# EAGLE design TPS62237 Breakout (EAGLE 9.5.2)
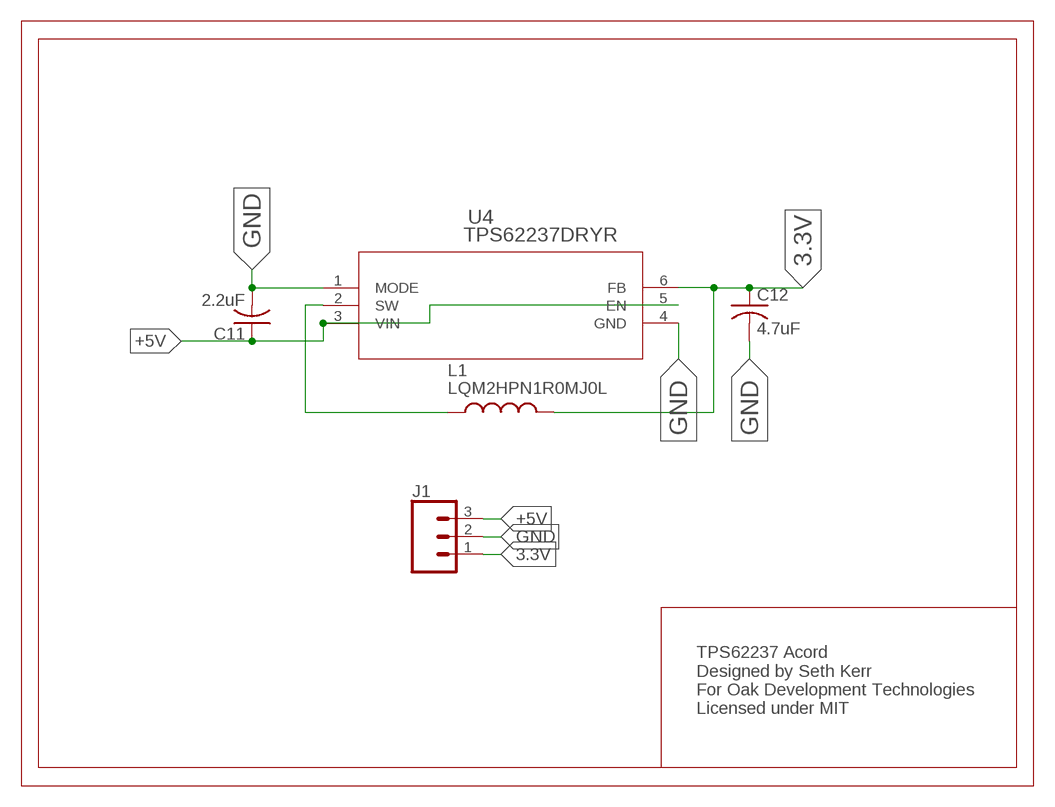
[diagram p0: schematic, sheet 1]

## Parts
C11  2.2uF  C-USC0603  [C0603]
C12  4.7uF  C-USC0603  [C0603]
J1  CONN_031X03_NO_SILK  [1X03_NO_SILK]
L1  LQM2HPN1R0MJ0L  [INDC2520X120N]
U4  TPS62237DRYR  [DRY6_TEX]

## Nets
3.3V: C12.1 J1.1 L1.2 U4.6(FB)
+5V: C11.1 J1.3 U4.3(VIN) U4.5(EN)
GND: C11.2 C12.2 J1.2 U4.1(MODE) U4.4(GND)
N$18: L1.1 U4.2(SW)

## Notes on the sheet
- TPS62237 Acord
  Designed by Seth Kerr
  For Oak Development Technologies
  Licensed under MIT

## Library data of the parts
C11 C12 = rcl:C-US: CAPACITOR, American symbol; SPICEPREFIX: C
J1 = SparkFun-Connectors:CONN_03: Multi connection point. Often used as Generic Header-pin footprint for 0.1 inch spaced/style header connections On any of the 0.1 inch spaced packages, you can populate with these: Break Away Headers - Straight <https://www.sparkfun.com/products/116> (PRT-00116) Break Away Male Headers - Right Angle <https://www.sparkfun.com/products/553> (PRT-00553) Female Headers <https://www.sparkfun.com/products/115> (PRT-00115) Break Away Headers - Machine Pin <https://www.sparkfun.com/products/117> (PRT-00117) Break Away Female Headers - Swiss Machine Pin <https://www.sparkfun.com/products/743> (PRT-00743) Stackable Header - 3 Pin (Female, 0.1") <https://www.sparkfun.com/products/13875> (PRT-13875) For SCREWTERMINALS and SPRING TERMINALS visit here: Screw Terimnals on SparkFun.com <https://www.sparkfun.com/search/results?term=Screw+Terminals> (5mm/3.5mm/2.54mm spacing) This device is also useful as a general connection point to wire up your design to another part of your project. Our various solder wires solder well into these plated through hole pads. Hook-Up Wire - Assortment (Stranded, 22 AWG) <https://www.sparkfun.com/products/11375> (PRT-11375) Hook-Up Wire - Assortment (Solid Core, 22 AWG) <https://www.sparkfun.com/products/11367> (PRT-11367) View the entire wire category on our website here <https://www.sparkfun.com/categories/141> Special notes: Molex polarized connector foot print use with SKU : PRT-08232 with associated crimp pins and housings.
L1 = LQM2HPN1R0MJ0L:LQM2HPN1R0MJ0L: FIXED IND 1UH 1.5A 90 MOHM SMD; ARROW_ELECTRONICS-PURCHASE-URL: https://snapeda.com/shop?store=Arrow+Electronics&id=53051; DESCRIPTION: Inductor with Inductance: 1uH Tol. +/-20%, Package: 1008 (2520); DIGI-KEY_PART_NUMBER: 490-6699-1-ND; DIGIKEY-PURCHASE-URL: https://snapeda.com/shop?store=DigiKey&id=53051; MF: Murata Electronics; MOUSER-PURCHASE-URL: https://snapeda.com/shop?store=Mouser&id=53051; MP: LQM2HPN1R0MJ0L; PACKAGE: 2520 Murata
U4 = TPS62237DRYR:TPS62237DRYR; BUILT_BY: EMA_UL_Team; MANUFACTURER: Texas Instruments; MANUFACTURER_PART_NUMBER: TPS62237DRYR; SOURCELIBRARY: TI_2014-06-19; VENDOR: Texas Instruments

## Board
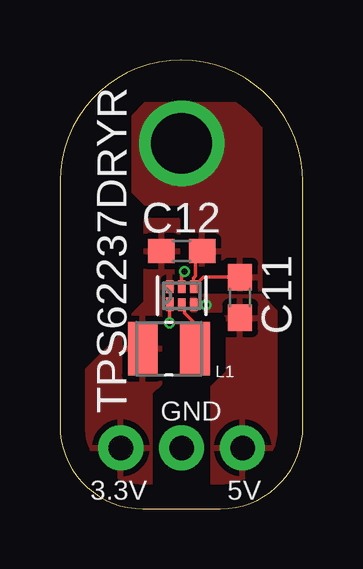
[diagram p1: board, top side]
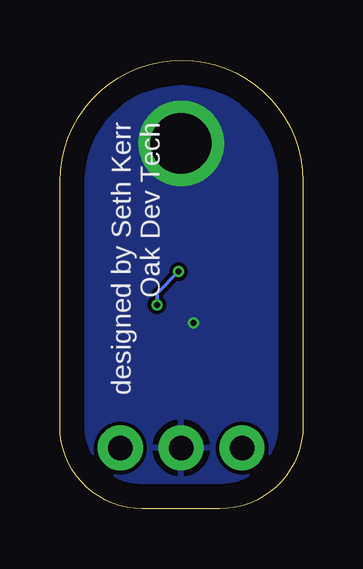
[diagram p2: board, bottom side, seen from below]

Size 10.14 x 18.72 mm. Coordinates in mm from the lower left corner, seen from the top.
Outline: 0,13.66 0,3.47 arc90 3.47,0 6.71,0 arc90 10.14,3.44 10.14,13.64 arc90 5.06,18.72 arc90 0,13.66
Copper layers (1*16): Top 0.035mm / dielectric 1.5mm / Bottom 0.035mm
Design rules "default *": minimum track width 6mil, minimum drill 10mil, track to track 6mil, track to pad 6mil, pad to pad 6mil, via to via 6mil, smd to smd 6mil, copper to edge 40mil, drill to drill 6mil, minimum pad ring 10mil, minimum via ring 4mil, stop-mask expansion 4mil, vias tented up to drill 25mil, thermal gap 10mil

### Footprints (pad centres in the part's own frame; a part is rotated, then mirrored left to right if it is on the bottom)
C0603 = smd 1.1 x 1: 1 -0.85,0; 2 0.85,0
1X03_NO_SILK = drill 1.016 pad 1.88: 1 0,0; 2 2.54,0; 3 5.08,0
INDC2520X120N = smd 1.24 x 2.22: 1 -1.09,0; 2 1.09,0
DRY6_TEX = smd 0.55 x 0.3: 1 -0.355,0.5 | smd 0.52 x 0.3: 2 -0.37,0; 3 -0.37,-0.5; 4 0.37,-0.5; 5 0.37,0; 6 0.37,0.5

### Placement (x,y rotation side)
C11  7.52,8.81 90 top
C12  5.08,10.74 0 top
J1  2.54,2.54 0 top
L1  4.55,6.68 180 top
U4  5.08,8.89 90 top

### Tracks (layer width: path | path; a pad name or v marks a point on that pad's centre or on a via)
3.3V
  pour Top: 4.95,12.06 4.95,10.16 4.83,10.03 4.83,9.02 4.7,8.89 4.32,8.89 4.19,8.76 4.19,5.21 3.81,4.83 3.81,-0.51 -0.51,-0.51 -0.51,4.19 2.79,7.49 2.79,7.87 3.56,8.64 3.56,12.06
+5V  (via drill 0.25)
  Top 0.152: U4.5 5.08,9.78 v5.19,9.89
  Bottom 0.152: v5.19,9.89 6.1,8.99 v6.1,8.51
  pour Top: 5.46,8.89 8.38,8.89 9.02,8.26 9.02,0 6.48,0 6.35,0.13 6.35,5.08 6.99,5.71 6.99,8 6.73,8.26 5.46,8.26
GND  (via drill 0.25, 2.54)
  Top 0.152: U4.1 v4.57,7.75 | C12.2 5.65,10.46 5.65,9.7 5.58,9.63 U4.4 5.98,9.66 C11.2
  other vias: 5.08,15.24
  pour Top: 5.46,12.7 5.46,10.29 5.59,10.16 6.99,10.16 7.11,10.03 7.11,9.14 8.38,9.14 8.38,16.64 8.13,16.89 3.56,16.89 3.05,16.38 3.05,13.21 3.56,12.7
  pour Bottom: -0.51,-0.51 10.54,-0.51 10.54,17.78 -0.51,17.78
N$18
  Top 0.152: U4.2 5.2,8.4 5.2,8.16 5.64,7.73 L1.1

### Text on the board
tNames: GND | 3.3V | 5V
bNames: designed by Seth Kerr / Oak Dev Tech